# Altium schematic sheet LWIR_Camera.SchDoc
size A4
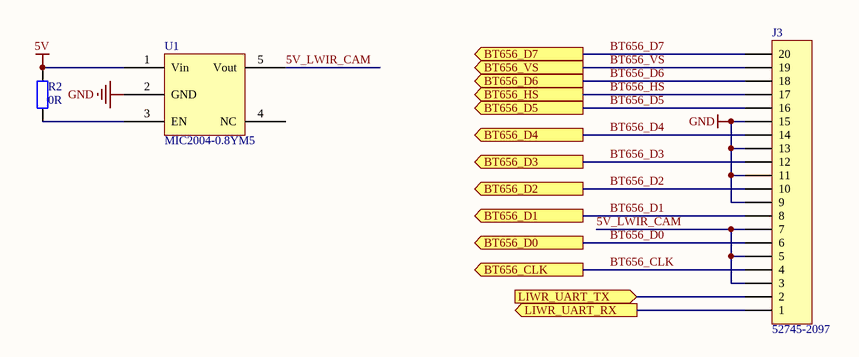
[diagram p0: LWIR_Camera.SchDoc]

## Parts
J3  52745-2097  [52745-2097]
R2  value 0R  [0402R_M]  (hidden comment: Generic resitor)
U1  MIC2004-0.8YM5  [SOT23_M5_L]

## Ports
BT656_CLK (out), BT656_D0 (out), BT656_D1 (out), BT656_D2 (out), BT656_D3 (out), BT656_D4 (out), BT656_D5 (out), BT656_D6 (out), BT656_D7 (out), BT656_HS (out), BT656_VS (out), LIWR_UART_RX (out), LIWR_UART_TX (in)

## Nets
5V: R2.2 U1.1(Vin)
GND: J3.9 J3.11 J3.13 J3.15 U1.2(GND)
5V_LWIR_CAM: J3.3 J3.5 J3.7 U1.5(Vout)
BT656_CLK: J3.4 ; port BT656_CLK
BT656_D0: J3.6 ; port BT656_D0
BT656_D1: J3.8 ; port BT656_D1
BT656_D2: J3.10 ; port BT656_D2
BT656_D3: J3.12 ; port BT656_D3
BT656_D4: J3.14 ; port BT656_D4
BT656_D5: J3.16 ; port BT656_D5
BT656_D6: J3.18 ; port BT656_D6
BT656_D7: J3.20 ; port BT656_D7
BT656_HS: J3.17 ; port BT656_HS
BT656_VS: J3.19 ; port BT656_VS
LIWR_UART_RX: J3.1 ; port LIWR_UART_RX
LIWR_UART_TX: J3.2 ; port LIWR_UART_TX
NetR2_1: R2.1 U1.3(EN)

Not connected (* = marked no-connect by the designer): U1 4(NC)

## Library data of the parts
J3 = 0527452097: CONN FFC TOP 20POS 0.50MM R/A; Manufacturer: Molex, LLC; Connector/Contact Type: Contacts, Top; Number of Positions: 20; Pitch: 0.020" (0.50mm); FFC, FCB Thickness: 0.30mm; Locking Feature: Slide Lock; Cable End Type: Straight; Voltage Rating: 50V; Current Rating: 0.5A; Supplier 1: Digi-Key; Manufacturer Part Number: 0527452097; RoHS: RoHS Compliant; Category: Connectors, Interconnects; Stock 1: 5293; Pricing 1: 1=1.82, 10=1.655, 25=1.5536, 50=1.4858, 100=1.4183, 250=1.28328, 500=1.18196 (USD); Packaging: Cut Tape (CT); Part Status: Active; Flat Flex Type: -; Mounting Type: Surface Mount, Right Angle; Termination: Solder; Height Above Board: 0.079" (2.00mm); Contact Material: Phosphor Bronze; Contact Finish: Gold; Housing Material: Polyamide (PA46), Nylon 4/6, Glass Filled; Actuator Material: -; Features: Solder Retention, Zero Insertion Force (ZIF); Operating Temperature: -20°C ~ 85°C; Material Flammability Rating: -; Contact Finish Thickness: -; Housing Color: -; Actuator Color: -; Mating Cycles: 20; ComponentLink1URL: http://www.molex.com/pdm_docs/sd/527452097_sd.pdf; ComponentLink1Description: http://www.molex.com/pdm_docs/sd/527452097_sd.pdf; Supplier Part Number 1: WM7974CT-ND
R2 = Resistor
U1 = MIC2004-0.8YM5: IC DISTRIBUTION SW 0.8A SOT23-5; Manufacturer: Microchip Technology; Switch Type: General Purpose; Number of Outputs: 1; Ratio - Input:Output: 1:1; Output Configuration: High Side; Output Type: P-Channel; Interface: On/Off; Voltage - Load: 2.5 V ~ 5.5 V; Voltage - Supply (Vcc/Vdd): Not Required; Current - Output (Max): 800mA; Rds On (Typ): 70 mOhm; Input Type: Non-Inverting; Fault Protection: Current Limiting (Fixed), Over Temperature; Supplier 1: Digi-Key; Manufacturer Part Number: MIC2004-0.8YM5; RoHS: RoHS Compliant; Category: Integrated Circuits (ICs); Stock 1: 0; Pricing 1: 1050=0 (USD); Packaging: Tube; Part Status: Obsolete; Features: Load Discharge; Operating Temperature: -40°C ~ 85°C (TA); Package / Case: SC-74A, SOT-753; Supplier Device Package: SOT-23-5; ComponentLink1URL: http://www.microchip.com/mymicrochip/filehandler.aspx?ddocname=en579487; ComponentLink1Description: http://www.microchip.com/mymicrochip/filehandler.aspx?ddocname=en579487; Supplier Part Number 1: MIC2004-0.8YM5-ND